# Altium project OTGW01_rev1.PrjPCB
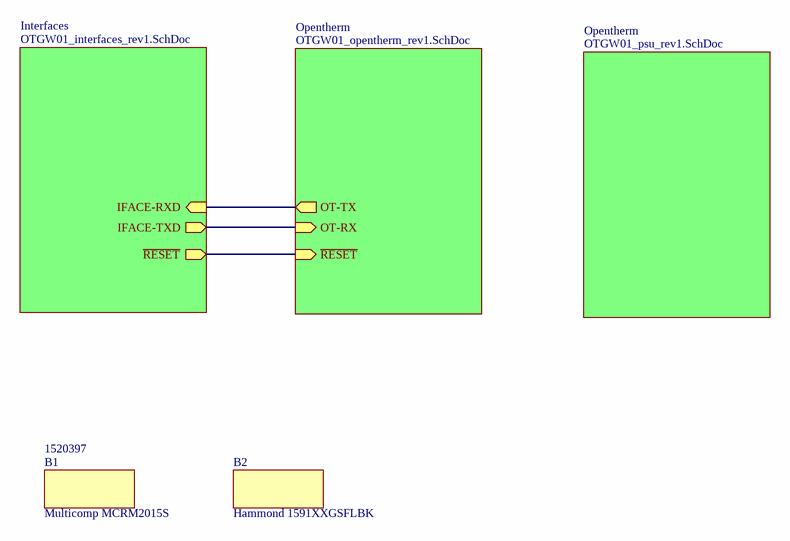
[diagram p0: OTGW01_rev1.SchDoc]
4 sheets, 100 parts. Net scope: hierarchical (ports join the sheet entries above them; power ports are global).
Board file: OTGW01_rev1.PcbDoc
Sheets:
  OTGW01_rev1.SchDoc
    Opentherm = OTGW01_opentherm_rev1.SchDoc
    Interfaces = OTGW01_interfaces_rev1.SchDoc
    Opentherm = OTGW01_psu_rev1.SchDoc

## Sheet OTGW01_rev1.SchDoc
size A4; SheetNumber: 1; PageSetup: Record=PageOptions|CenterHorizontal=True|CenterVertical=True|PrintScale=1.00|XCorrection=1.00|YCorrection=1.00|PrintKind=0|BorderSize=5000000|LeftOffset=0|BottomOffset=0|Orientation=2|PaperLength=1000|PaperWidth=1000|Scale=100|PaperSource=7|PrintQuality=-3|MediaType=1|DitherType=10|PrintScaleMode=1|PaperKind=A4|PaperIndex=9

### Parts
B1  Multicomp MCRM2015S  Supplier Part Number 1: 1520397
B2  Hammond 1591XXGSFLBK

### Sub-sheets
Interfaces = OTGW01_interfaces_rev1.SchDoc: IFACE-RXD (in), IFACE-TXD (out), ~{RESET} (out)
Opentherm = OTGW01_opentherm_rev1.SchDoc: OT-TX (out), OT-RX (in), ~{RESET} (in)
Opentherm = OTGW01_psu_rev1.SchDoc: no entries

### Nets
GPIO12: sheet Opentherm/~{RESET}, sheet Interfaces/~{RESET}
IFACE-RXD: sheet Opentherm/OT-TX, sheet Interfaces/IFACE-RXD
IFACE-TXD: sheet Opentherm/OT-RX, sheet Interfaces/IFACE-TXD

### Library data of the parts
B1 = BOMpart: Supplier 1: Farnell
B2 = BOMpart: Description: HAMMOND - 1591XXGSFLBK - ENCLOSURE, MULTIPURPOSE, FLNG LID; Supplier 1: Farnell; Supplier Part Number 1: 1877170

## Sheet OTGW01_opentherm_rev1.SchDoc
size A4; SheetNumber: 3
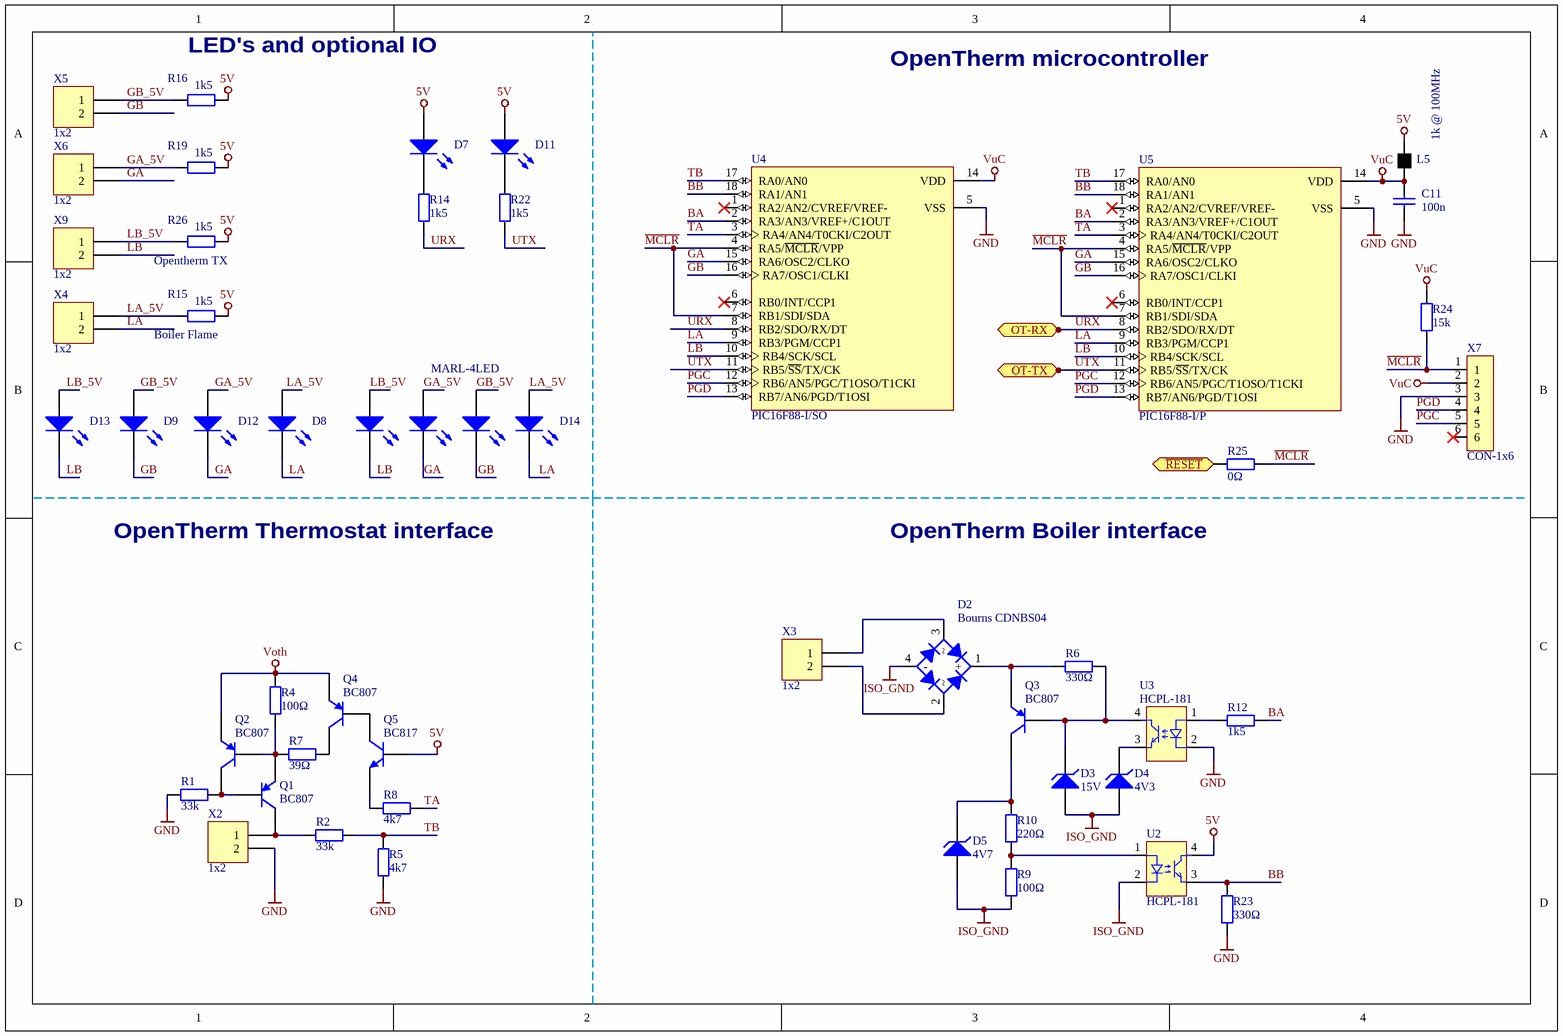
[diagram p1: OTGW01_opentherm_rev1.SchDoc]

### Parts
C11  100n  [0805]
D2  Bourns CDNBS04  [SOD-106]
D3  15V  [SOD123]
D4  4V3  [SOD123]
D5  4V7  [SOD123]
D7  PLCC2 LED  [PLCC2]  (value not drawn)
D8  PLCC2 LED  [PLCC2]  (value not drawn)
D9  PLCC2 LED  [PLCC2]  (value not drawn)
D11  PLCC2 LED  [PLCC2]  (value not drawn)
D12  PLCC2 LED  [PLCC2]  (value not drawn)
D13  PLCC2 LED  [PLCC2]  (value not drawn)
D14  MARL-4LED  [MARL-4LED]
L5  1k @ 100MHz  [0805]
Q1  BC807  [SOT23]
Q2  BC807  [SOT23]
Q3  BC807  [SOT23]
Q4  BC807  [SOT23]
Q5  BC817  [SOT23]
R1  33k  [0805]
R2  33k  [0805]
R4  100Ω  [0805]
R5  4k7  [0805]
R6  330Ω  [0805]
R7  39Ω  [0805]
R8  4k7  [0805]
R9  100Ω  [0805]
R10  220Ω  [0805]
R12  1k5  [0805]
R14  1k5  [0805]
R15  1k5  [0805]
R16  1k5  [0805]
R19  1k5  [0805]
R22  1k5  [0805]
R23  330Ω  [0805]
R24  15k  [0805]
R25  0Ω  [0805]
R26  1k5  [0805]
U2  HCPL-181  [HCPL-181]
U3  HCPL-181  [HCPL-181]
U4  PIC16F88-I/SO  [SOIC18]
U5  PIC16F88-I/P  [PDIP300-P18]
X2  1x2  [Terminal_2x3.5mm]
X3  1x2  [Terminal_2x3.5mm]
X4  1x2  [Terminal_2x3.5mm]
X5  1x2  [Terminal_2x3.5mm]
X6  1x2  [Terminal_2x3.5mm]
X7  CON-1x6  [SIL-1x6-2.54]
X9  1x2  [Terminal_2x3.5mm]

### Ports
OT-RX (in), OT-TX (out), ~{RESET} (in)

### Nets
5V: D7.1(A) D11.1(A) L5.2(OUT) Q5.3(B) R15.2 R16.2 R19.2 R26.2 U2.4(D)
GND: C11.1 R1.1 R5.1 R23.2 U3.2(B) U4.5(VSS) U5.5(VSS) X2.2 X7.3
ISO_GND: D2.4(-) D3.2(Anode) D4.2(Anode) D5.2(Anode) R9.2 U2.2(B)
Voth: Q2.2(E) Q4.2(E) R4.2
VuC: C11.2 L5.1(IN) R24.1 U4.14(VDD) U5.14(VDD) X7.2
BA: R12.1 U4.2(RA3/AN3/VREF+/C1OUT) U5.2(RA3/AN3/VREF+/C1OUT)
BB: R23.1 U2.3(C) U4.18(RA1/AN1) U5.18(RA1/AN1)
GA: D12.2(K) D14.6(K) U4.15(RA6/OSC2/CLKO) U5.15(RA6/OSC2/CLKO) X6.2
GA_5V: D12.1(A) D14.5(A) R19.1 X6.1
GB: D9.2(K) D14.4(K) U4.16(RA7/OSC1/CLKI) U5.16(RA7/OSC1/CLKI) X5.2
GB_5V: D9.1(A) D14.3(A) R16.1 X5.1
GPIO12: R25.1 ; port ~{RESET}
LA: D8.2(K) D14.2(K) U4.9(RB3/PGM/CCP1) U5.9(RB3/PGM/CCP1) X4.2
LA_5V: D8.1(A) D14.1(A) R15.1 X4.1
LB: D13.2(K) D14.8(K) U4.10(RB4/SCK/SCL) U5.10(RB4/SCK/SCL) X9.2
LB_5V: D13.1(A) D14.7(A) R26.1 X9.1
~{MCLR}: R24.2 R25.2 U4.4(RA5/~{MCLR}/VPP) U4.7(RB1/SDI/SDA) U5.4(RA5/~{MCLR}/VPP) U5.7(RB1/SDI/SDA) X7.1
PGC: U4.12(RB6/AN5/PGC/T1OSO/T1CKI) U5.12(RB6/AN5/PGC/T1OSO/T1CKI) X7.5
PGD: U4.13(RB7/AN6/PGD/T1OSI) U5.13(RB7/AN6/PGD/T1OSI) X7.4
TA: R8.2 U4.3(RA4/AN4/T0CKI/C2OUT) U5.3(RA4/AN4/T0CKI/C2OUT)
TB: R2.2 R5.2 U4.17(RA0/AN0) U5.17(RA0/AN0)
URX: R14.1 U4.8(RB2/SDO/RX/DT) U5.8(RB2/SDO/RX/DT) ; port OT-RX  [project net IFACE-TXD]
UTX: R22.1 U4.11(RB5/~{SS}/TX/CK) U5.11(RB5/~{SS}/TX/CK) ; port OT-TX  [project net IFACE-RXD]
NetD2_1: D2.1(+) Q3.2(E) R6.2
NetD2_2: D2.2 X3.2
NetD2_3: D2.3 X3.1
NetD3_1: D3.1(Cathode) Q3.1(B) R6.1 U3.4(D)
NetD4_1: D4.1(Cathode) U3.3(C)
NetD5_1: D5.1(Cathode) Q3.3(C) R10.1
NetD7_2: D7.2(K) R14.2
NetD11_2: D11.2(K) R22.2
NetQ1_1: Q1.1(B) Q2.3(C) R1.2
NetQ1_2: Q1.2(E) Q2.1(B) R4.1 R7.1
NetQ1_3: Q1.3(C) R2.1 X2.1
NetQ4_1: Q4.1(B) Q5.2(C)
NetQ4_3: Q4.3(C) R7.2
NetQ5_1: Q5.1(E) R8.1
NetR9_1: R9.1 R10.2 U2.1(A)
NetR12_2: R12.2 U3.1(A)

Not connected (* = marked no-connect by the designer): U4 1(RA2/AN2/CVREF/VREF-)* 6(RB0/INT/CCP1)*; U5 1(RA2/AN2/CVREF/VREF-)* 6(RB0/INT/CCP1)*; X7 6*

### Notes on the sheet
- (near R16) LED's and optional IO
- OpenTherm microcontroller
- (near R26) Opentherm TX
- (near R15) Boiler Flame
- OpenTherm Thermostat interface
- OpenTherm Boiler interface

### Library data of the parts
C11 = C: Capacitor Non Polarized; Supplier 1: Farnell; Supplier Part Number 1: 2470437
D2 = Bridge: Full Wave Diode Bridge; Supplier 1: Farnell; Supplier Part Number 1: 1899476
D3-D5 = D_Z: Zener Diode; Supplier 1: Farnell
  D3: Supplier Part Number 1: 1843720
  D4: Supplier Part Number 1: 2077927
  D5: Supplier Part Number 1: 1902435
D7-D9 D11-D13 = LED: Supplier 1: Farnell; Supplier Part Number 1: 2450615
L5 = Ferrite: Supplier 1: Farnell; Supplier Part Number 1: 1635737
Q1-Q4 = PNP: PNP Medium Power Transistor; Supplier 1: Farnell; Supplier Part Number 1: 2319246
Q5 = NPN: NPN Medium Power Transistor; Supplier 1: Farnell; Supplier Part Number 1: 1081223
R1 R2 R4-R10 R12 R14-R16 R19 R22-R26 = R: Resistor; Supplier 1: Farnell
  R1 R2: Supplier Part Number 1: 9333053
  R4 R9: Supplier Part Number 1: 9332375
  R5 R8: Supplier Part Number 1: 9333266
  R6 R23: Supplier Part Number 1: 9333037
  R7: Supplier Part Number 1: 9333193
  R10: Supplier Part Number 1: 9332804
  R12 R14-R16 R19 R22 R26: Supplier Part Number 1: 9332600
  R24: Supplier Part Number 1: 9332618
  R25: Supplier Part Number 1: 9233750
U4 U5 = MC-8B-16F88-IL18: Supplier 1: Farnell
  U4: Supplier Part Number 1: 9761519
  U5: Supplier Part Number 1: 9761500
X2-X6 X9 = CON_1x2: Supplier 1: Farnell; Supplier Part Number 1: 1098611
D14 = MARL-4LED: Supplier 1: Farnell; Supplier Part Number 1: 9737367
U2 U3 = HCPL-181: Supplier 1: Farnell; Supplier Part Number 1: 1244525

## Sheet OTGW01_interfaces_rev1.SchDoc
size A4; SheetNumber: 2
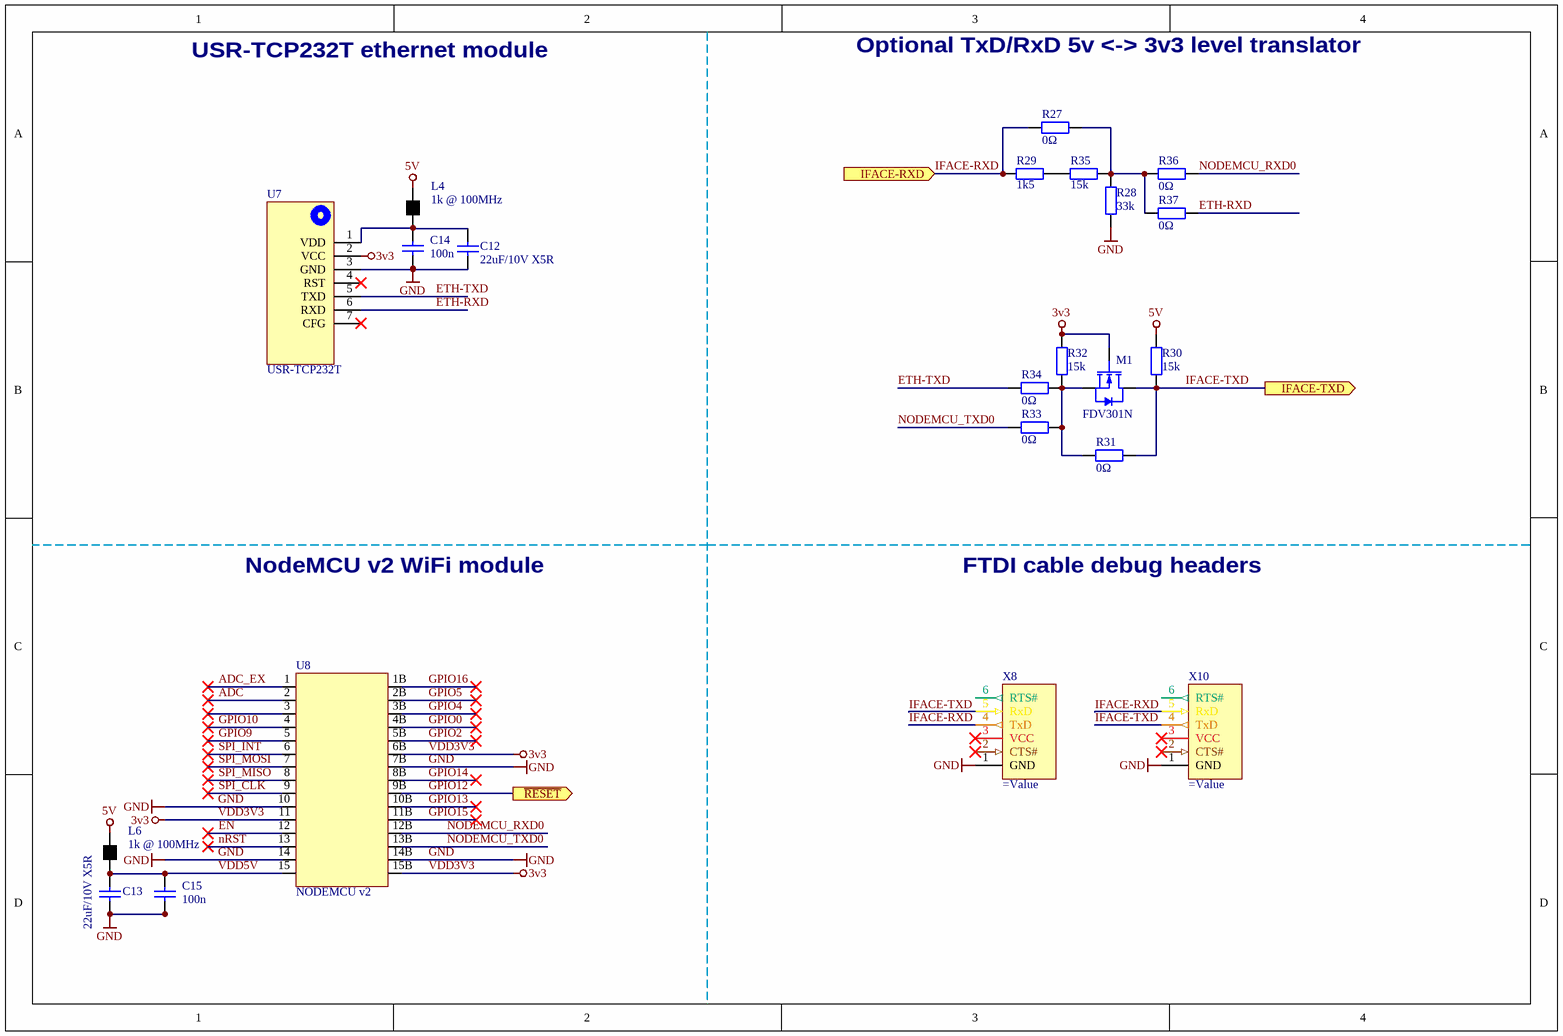
[diagram p2: OTGW01_interfaces_rev1.SchDoc]

### Parts
C12  22uF/10V X5R  [1210]
C13  22uF/10V X5R  [1210]
C14  100n  [0805]
C15  100n  [0805]
L4  1k @ 100MHz  [0805]
L6  1k @ 100MHz  [0805]
M1  FDV301N  [SOT23]
R27  0Ω  [0805]
R28  33k  [0805]
R29  1k5  [0805]
R30  15k  [0805]
R31  0Ω  [0805]
R32  15k  [0805]
R33  0Ω  [0805]
R34  0Ω  [0805]
R35  15k  [0805]
R36  0Ω  [0805]
R37  0Ω  [0805]
U7  USR-TCP232T  [USR-TCP232-T]
U8  NODEMCU v2  [NODEMCU]
X8  (no value)  [SIL-1x6-2.54]
X10  (no value)  [SIL-1x6-2.54]

### Ports
IFACE-RXD (in), IFACE-TXD (out), ~{RESET} (out)

### Nets
5V: L4.2(OUT) L6.2(OUT) R30.1
GND: C12.1 C13.1 C14.1 C15.1 R28.1 U7.3(GND) U8.7B U8.10 U8.14 U8.14B X8.1(GND) X10.1(GND)
VDD3V3: M1.1(G) R32.1 U7.2(VCC) U8.6B U8.11 U8.15B  [also labelled 3v3]
ADC: U8.2
ADC_EX: U8.1
EN: U8.12
ETH-RXD: R37.2 U7.6(RXD)
ETH-TXD: R34.1 U7.5(TXD)
GPIO0: U8.4B
GPIO2: U8.5B
GPIO4: U8.3B
GPIO5: U8.2B
GPIO9: U8.5
GPIO10: U8.4
GPIO12: U8.9B ; port ~{RESET}
GPIO13: U8.10B
GPIO14: U8.8B
GPIO15: U8.11B
GPIO16: U8.1B
IFACE-RXD: R27.1 R29.1 X8.4(TxD) X10.5(RxD) ; port IFACE-RXD
IFACE-TXD: M1.2(D) R30.2 R31.2 X8.5(RxD) X10.4(TxD) ; port IFACE-TXD
NODEMCU_RXD0: R36.2 U8.12B
NODEMCU_TXD0: R33.1 U8.13B
nRST: U8.13
SPI_CLK: U8.9
SPI_INT: U8.6
SPI_MISO: U8.8
SPI_MOSI: U8.7
VDD5V: C13.2 C15.2 L6.1(IN) U8.15
NetC12_2: C12.2 C14.2 L4.1(IN) U7.1(VDD)
NetM1_3: M1.3(S) R31.1 R32.2 R33.2 R34.2
NetR27_2: R27.2 R28.2 R35.2 R36.1 R37.1
NetR29_2: R29.2 R35.1

Not connected (* = marked no-connect by the designer): U7 4(RST)* 7(CFG)*; U8 3*; X8 2(CTS#)* 3(VCC)* 6(RTS#); X10 2(CTS#)* 3(VCC)* 6(RTS#)

### Notes on the sheet
- USR-TCP232T ethernet module
- Optional TxD/RxD 5v <-> 3v3 level translator
- NodeMCU v2 WiFi module
- FTDI cable debug headers

### Library data of the parts
C12-C15 = C: Capacitor Non Polarized; Supplier 1: Farnell
  C12 C13: Supplier Part Number 1: 2497183
  C14 C15: Supplier Part Number 1: 2470437
L4 L6 = Ferrite: Supplier 1: Farnell; Supplier Part Number 1: 1635737
M1 = FET_N: Supplier 1: Farnell; Supplier Part Number 1: 9845011
R27-R37 = R: Resistor; Supplier 1: Farnell
  R27 R31 R33 R34 R36 R37: Supplier Part Number 1: 9233750
  R28: Supplier Part Number 1: 9333053
  R29: Supplier Part Number 1: 9332600
  R30 R32 R35: Supplier Part Number 1: 9332618
U7 = USR-TCP232-T
U8 = NODEMCU
X8 X10 = TTL-232R: FTDI cable TTL232R footprint

## Sheet OTGW01_psu_rev1.SchDoc
size A4; SheetNumber: 4
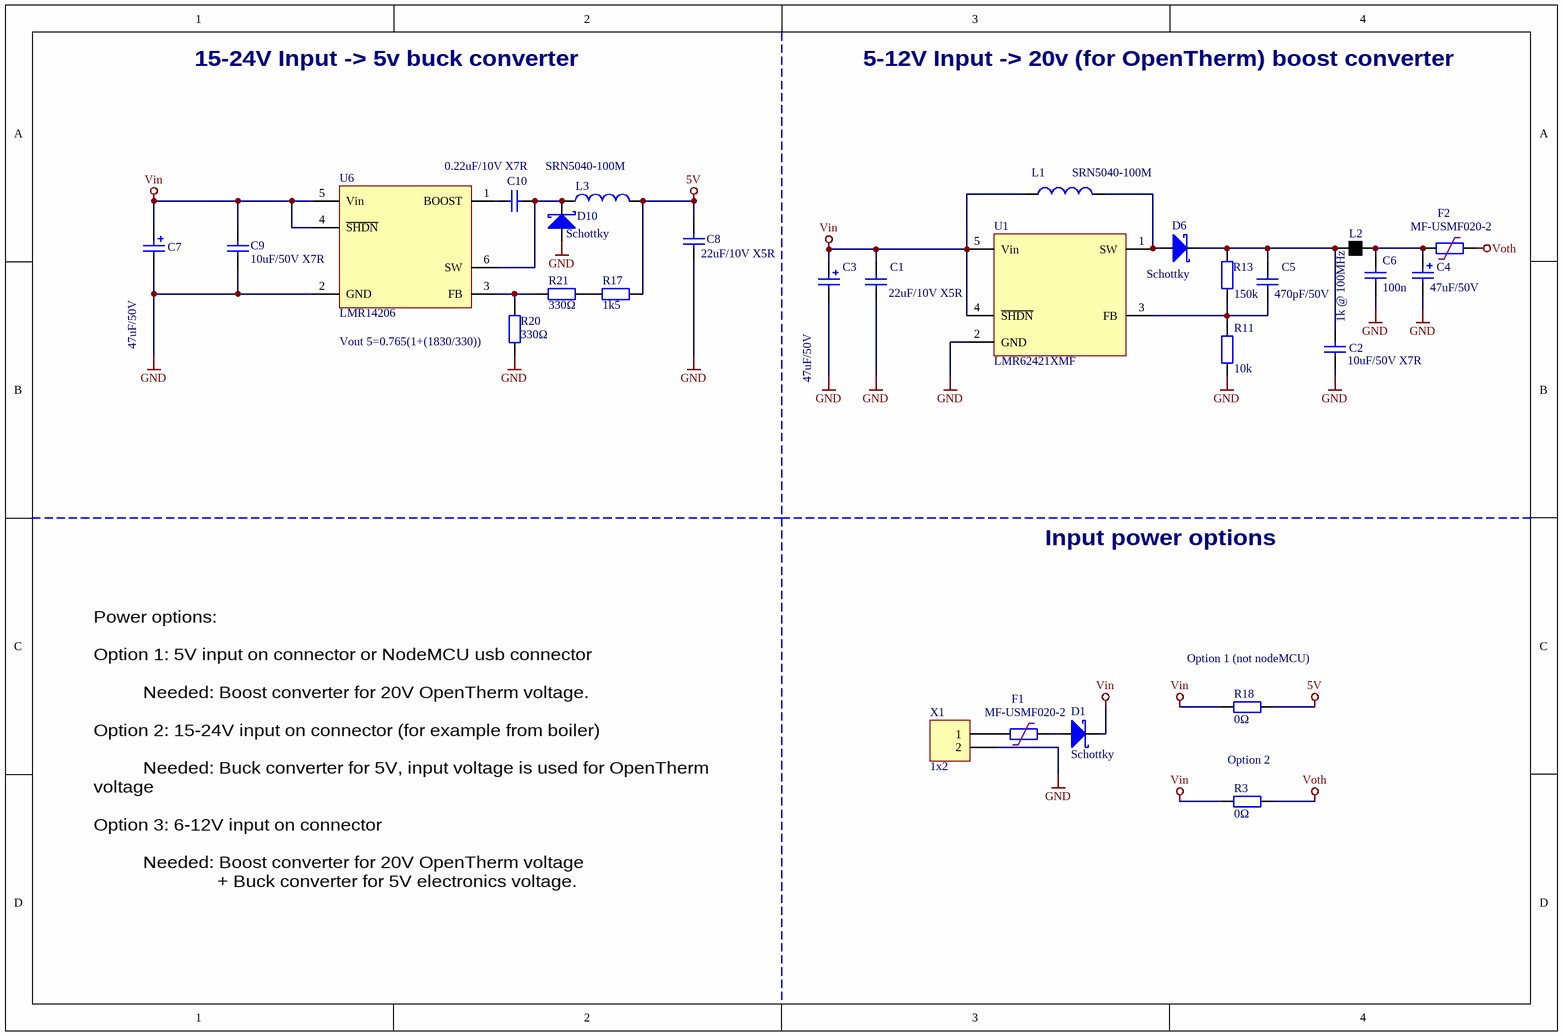
[diagram p3: OTGW01_psu_rev1.SchDoc]

### Parts
C1  22uF/10V X5R  [1210]
C2  10uF/50V X7R  [1210]
C3  47uF/50V  [C_D8]
C4  47uF/50V  [C_D8]
C5  470pF/50V  [0805]
C6  100n  [0805]
C7  47uF/50V  [C_D8]
C8  22uF/10V X5R  [1210]
C9  10uF/50V X7R  [1210]
C10  0.22uF/10V X7R  [0805]
D1  Schottky  [SOD123]
D6  Schottky  [SOD123]
D10  Schottky  [SOD123]
F1  MF-USMF020-2  [1210F]
F2  MF-USMF020-2  [1210F]
L1  SRN5040-100M  [SRN5040]
L2  1k @ 100MHz  [0805]
L3  SRN5040-100M  [SRN5040]
R3  0Ω  [0805]
R11  10k  [0805]
R13  150k  [0805]
R17  1k5  [0805]
R18  0Ω  [0805]
R20  330Ω  [0805]
R21  330Ω  [0805]
U1  LMR62421XMF  [SOT23_5]
U6  LMR14206  [SOT23_6]
X1  1x2  [Terminal_2x3.5mm]

### Nets
5V: C8.2 L3.2 R17.2 R18.2
GND: C1.1 C2.2 C3.2 C4.2 C6.1 C7.2 C8.1 C9.1 D10.2 R11.2 R20.1 U1.2(GND) U6.2(GND) X1.2
Vin: C1.2 C3.1 C7.1 C9.2 D1.1 L1.1 R3.1 R18.1 U1.4(~{SHDN}) U1.5(Vin) U6.4(~{SHDN}) U6.5(Vin)
Voth: F2.2 R3.2
NetC2_1: C2.1 C5.1 D6.1 L2.2(OUT) R13.1
NetC4_1: C4.1 C6.2 F2.1 L2.1(IN)
NetC5_2: C5.2 R11.1 R13.2 U1.3(FB)
NetC10_1: C10.1 D10.1 L3.1 U6.6(SW)
NetC10_2: C10.2 U6.1(BOOST)
NetD1_2: D1.2 F1.2
NetD6_2: D6.2 L1.2 U1.1(SW)
NetF1_1: F1.1 X1.1
NetR17_1: R17.1 R21.2
NetR20_2: R20.2 R21.1 U6.3(FB)

### Notes on the sheet
- 15-24V Input -> 5v buck converter
- 5-12V Input -> 20v (for OpenTherm) boost converter
- (near R20) Vout 5=0.765(1+(1830/330))
- Input power options
- (near R18) Option 1 (not nodeMCU)
- Option 2
- Power options:
  Option 1: 5V input on connector or NodeMCU usb connector
  Needed: Boost converter for 20V OpenTherm voltage.
  Option 2: 15-24V input on connector (for example from boiler)
  Needed: Buck converter for 5V, input voltage is used for OpenTherm voltage
  Option 3: 6-12V input on connector
  Needed: Boost converter for 20V OpenTherm voltage
  + Buck converter for 5V electronics voltage.

### Library data of the parts
C1 C2 C5 C6 C8-C10 = C: Capacitor Non Polarized; Supplier 1: Farnell
  C1 C8: Supplier Part Number 1: 2497183
  C2 C9: Supplier Part Number 1: 2362133
  C5: Supplier Part Number 1: 1520294
  C6: Supplier Part Number 1: 2470437
  C10: Supplier Part Number 1: 2409051
C3 C4 C7 = C_POL: Capacitor Polarized; Supplier 1: Farnell; Supplier Part Number 1: 1850121
D1 D6 D10 = D_S: Supplier 1: Farnell; Supplier Part Number 1: 2284963
F1 F2 = PPTC: Supplier 1: Farnell; Supplier Part Number 1: 1294883
L1 L3 = L: Supplier 1: Farnell; Supplier Part Number 1: 2428234
L2 = Ferrite: Supplier 1: Farnell; Supplier Part Number 1: 1635737
R3 R11 R13 R17 R18 R20 R21 = R: Resistor; Supplier 1: Farnell
  R3 R18: Supplier Part Number 1: 9233750
  R11: Supplier Part Number 1: 9332391
  R13: Supplier Part Number 1: 9332626
  R17: Supplier Part Number 1: 9332600
  R20 R21: Supplier Part Number 1: 9333037
X1 = CON_1x2: Supplier 1: Farnell; Supplier Part Number 1: 1098611
U1 = LMR62421XMF: Supplier 1: Farnell; Supplier Part Number 1: 2064678
U6 = LMR14206: Supplier 1: Farnell; Supplier Part Number 1: 2323514

## Nets that join several sheets
5V: OTGW01_opentherm_rev1 (9 pins), OTGW01_interfaces_rev1 (L4.2 L6.2 R30.1), OTGW01_psu_rev1 (C8.2 L3.2 R17.2 R18.2)
GND: OTGW01_opentherm_rev1 (9 pins), OTGW01_interfaces_rev1 (12 pins), OTGW01_psu_rev1 (14 pins)
Voth: OTGW01_opentherm_rev1 (Q2.2 Q4.2 R4.2), OTGW01_psu_rev1 (F2.2 R3.2)
GPIO12: OTGW01_opentherm_rev1 (R25.1), OTGW01_interfaces_rev1 (U8.9B)
IFACE-RXD: OTGW01_opentherm_rev1 (R22.1 U4.11 U5.11), OTGW01_interfaces_rev1 (R27.1 R29.1 X8.4 X10.5)
IFACE-TXD: OTGW01_opentherm_rev1 (R14.1 U4.8 U5.8), OTGW01_interfaces_rev1 (5 pins)

## Assembly variants
OTGW01_rev1-WiFi-usbpower-desk-soic: not fitted B2 C7 C8 C9 C10 C12 C14 D1 D8 D9 D10 D12 D13 F1 L3 L4 R3 R17 R18 R20 R21 R25 R27 R31 R34 R37 U5 U6 U7 X1 X4 X5 X6 X7 X8 X9 X10
OTGW01_rev1-WiFi-usbpower-wall-dip-boardled: not fitted B1 C7 C8 C9 C10 C12 C14 D1 D10 D14 F1 L3 L4 R3 R17 R18 R20 R21 R25 R27 R31 R34 R37 U4 U6 U7 X1 X4 X5 X6 X7 X8 X9 X10
OTGW01_rev1-Eth-ext_5V-desk-soic: not fitted B2 C7 C8 C9 C10 C13 C15 D8 D9 D10 D12 D13 L3 L6 R3 R17 R20 R21 R25 R27 R31 R33 R36 U5 U6 U8 X4 X5 X6 X7 X8 X9 X10
OTGW01_rev1-Eth-ext_5V-wall-soic-extled: not fitted B1 C7 C8 C9 C10 C13 C15 D8 D9 D10 D12 D13 D14 L3 L6 R3 R17 R20 R21 R25 R27 R31 R33 R36 U5 U6 U8 X7 X8 X10
OTGW01_rev1-Eth-ext_15-20V-desk-soic-boardled: not fitted B2 C1 C2 C3 C4 C5 C6 C13 C15 D6 D14 F2 L1 L2 L6 R11 R13 R18 R25 R27 R31 R33 R36 U1 U5 U8 X4 X5 X6 X7 X8 X9 X10